# EAGLE design MRA11 (EAGLE 5.11)
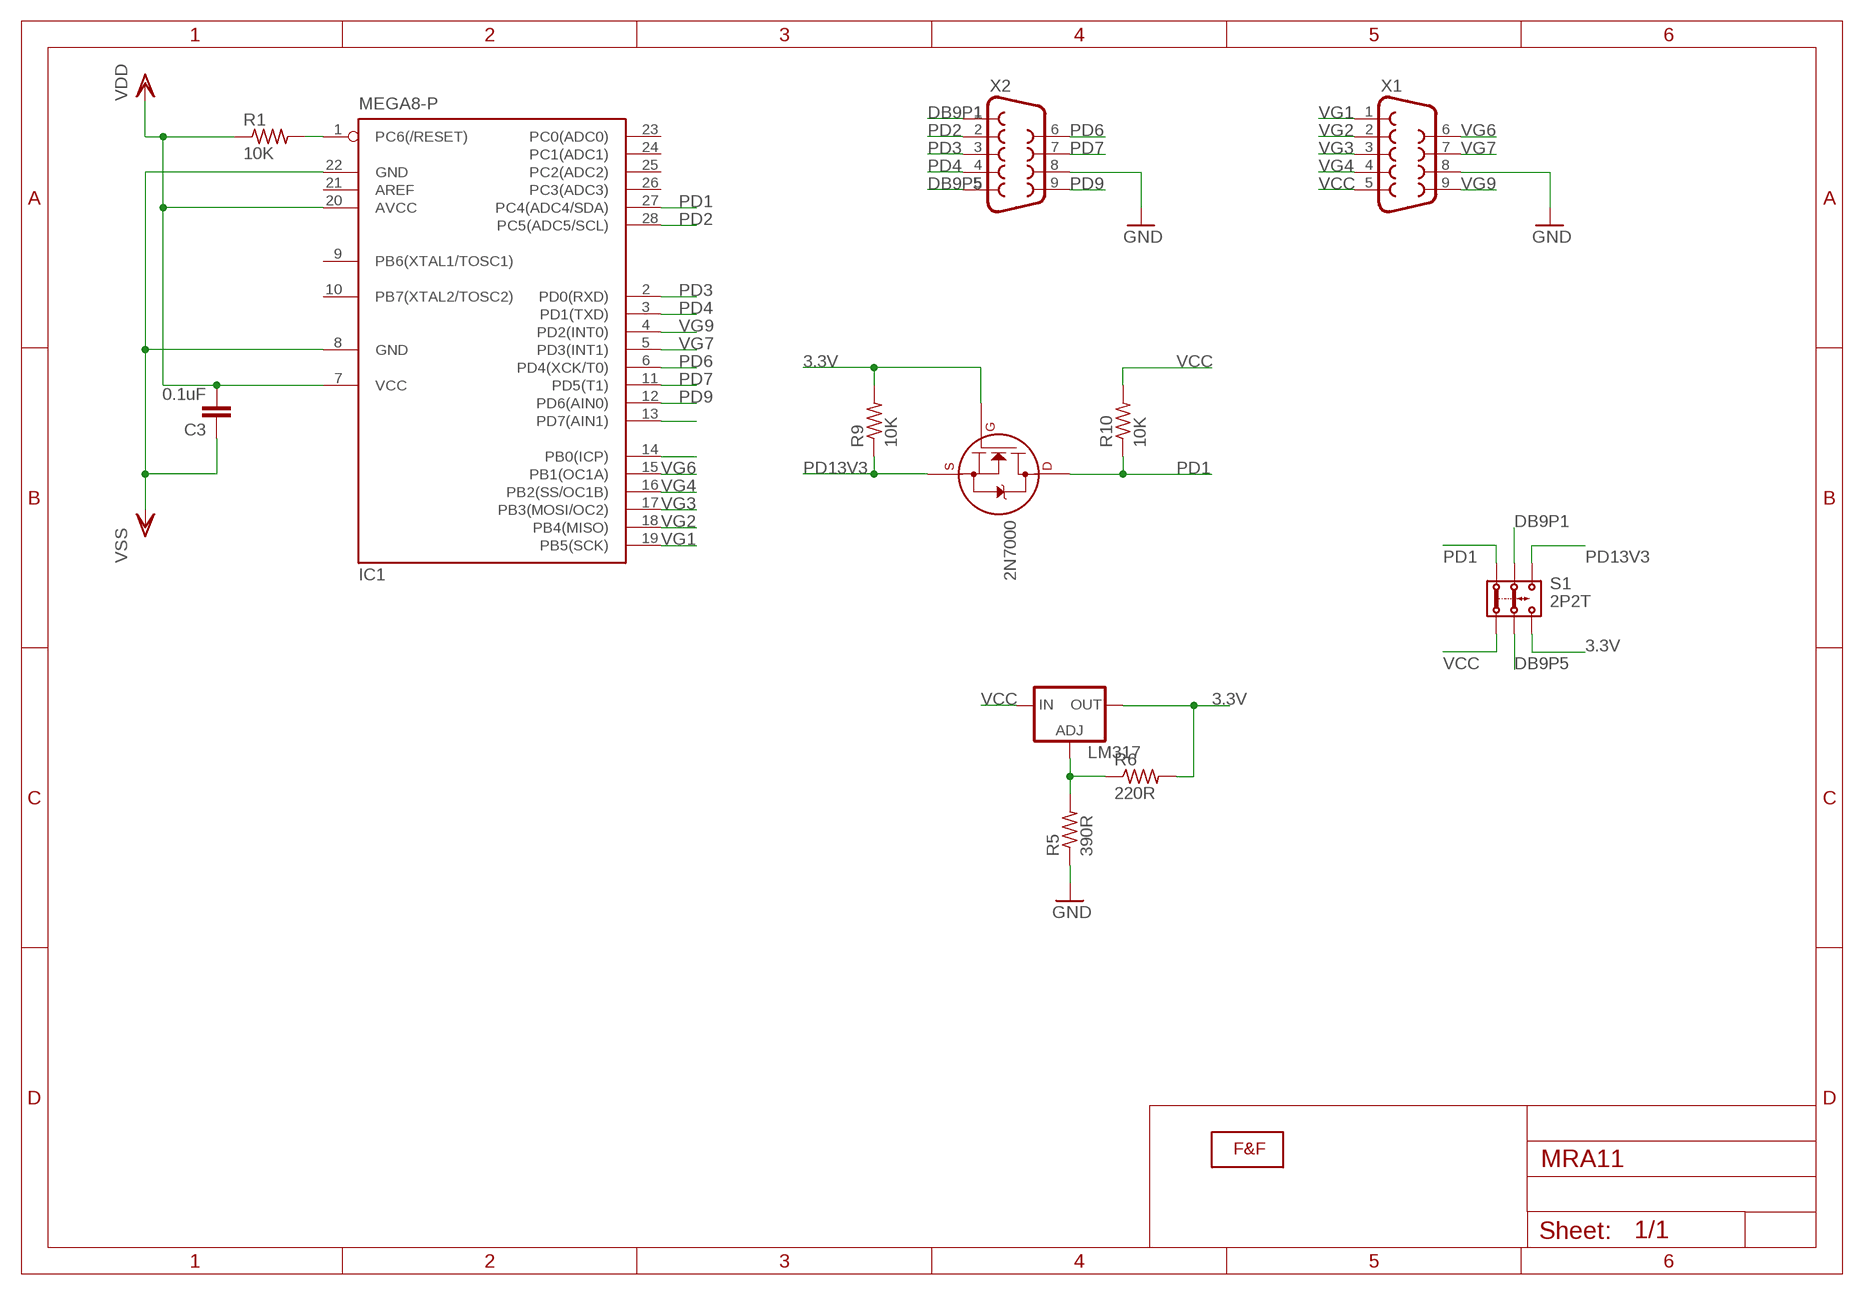
[diagram p0: schematic, sheet 1]

## Parts
2N7000  2N7000_TO92  [TO-92]
C3  0.1uF  C-EU050-024X044  [C050-024X044]
IC1  MEGA8-P  [DIL28-3]
LM317  LM317TS  [317TS]
R1  10K  R-US_0207/10  [0207/10]
R5  390R  R-US_0207/10  [0207/10]
R6  220R  R-US_0207/10  [0207/10]
R9  10K  R-US_0207/10  [0207/10]
R10  10K  R-US_0207/10  [0207/10]
S1  2P2T  [2P2T]
U$1  LOGOLOGO_WITHOUT_SMOKE_SMALL  [LOGO2_SMALL]
X1  DB9MALE  [DB9_MALE]
X2  DB9MALE  [DB9_MALE]

## Nets
3.3V: 2N7000.2(G) LM317.2(OUT) R6.2 R9.2 S1.3.2
DB9P1: S1.2.1 X2.1
DB9P5: S1.2.2 X2.5
GND: C3.1 IC1.8(GND) IC1.22(GND) R5.1 X1.8 X2.8 ; supply symbol labelled VSS
N$1: IC1.1(PC6(/RESET)) R1.2
N$2: IC1.13(PD7(AIN1))
N$4: IC1.14(PB0(ICP))
N$5: LM317.1(ADJ) R5.2 R6.1
PD1: 2N7000.3(D) IC1.27(PC4(ADC4/SDA)) R10.1 S1.1.1
PD2: IC1.28(PC5(ADC5/SCL)) X2.2
PD3: IC1.2(PD0(RXD)) X2.3
PD4: IC1.3(PD1(TXD)) X2.4
PD6: IC1.6(PD4(XCK/T0)) X2.6
PD7: IC1.11(PD5(T1)) X2.7
PD9: IC1.12(PD6(AIN0)) X2.9
PD13V3: 2N7000.1(S) R9.1 S1.3.1
VCC: C3.2 IC1.7(VCC) IC1.20(AVCC) LM317.3(IN) R1.1 R10.2 S1.1.2 X1.5 ; supply symbol labelled VDD
VG1: IC1.19(PB5(SCK)) X1.1
VG2: IC1.18(PB4(MISO)) X1.2
VG3: IC1.17(PB3(MOSI/OC2)) X1.3
VG4: IC1.16(PB2(SS/OC1B)) X1.4
VG6: IC1.15(PB1(OC1A)) X1.6
VG7: IC1.5(PD3(INT1)) X1.7
VG9: IC1.4(PD2(INT0)) X1.9
Unconnected: IC1.9(PB6(XTAL1/TOSC1)) IC1.10(PB7(XTAL2/TOSC2)) IC1.21(AREF) IC1.23(PC0(ADC0)) IC1.24(PC1(ADC1)) IC1.25(PC2(ADC2)) IC1.26(PC3(ADC3))

## Library data of the parts
2N7000 = transistors:2N700*: 2N7000, 2N7002, NDS7002A N-channel enhancement mode MOSFET
C3 = rcl:C-EU: CAPACITOR, European symbol
IC1 = atmel:MEGA8-P: MICROCONTROLLER 8 Kbytes FLASH, 1 kbytes SRAM, 512 bytes EEPROM, USART, 4-channel 10 bit ADC, 2-channel 8 bit ADC Pin compatible with Atmega48, ATMega88, ATMega168 Source: avr.lbr; OC_FARNELL: unknown; OC_NEWARK: unknown
LM317 = v-reg:LM317TS: VOLTAGE REGULATOR
R1 R5 R6 R9 R10 = adafruit:R-US_: RESISTOR, American symbol
S1 = Itead_BP_110825:2P2T: BAS011
U$1 = F&F:LOGO: Faísca e Fumaça Logo faiscaefumaca.com.br
X1 X2 = SparkFun:DB9: DB9 Connector Standard DB9 (D-Sub 9) serial connector. Can be used for CAN bus as well as RS485 and RS232. Footprint production proven. Spark Fun Electronics SKU : PRT-00429

## Board
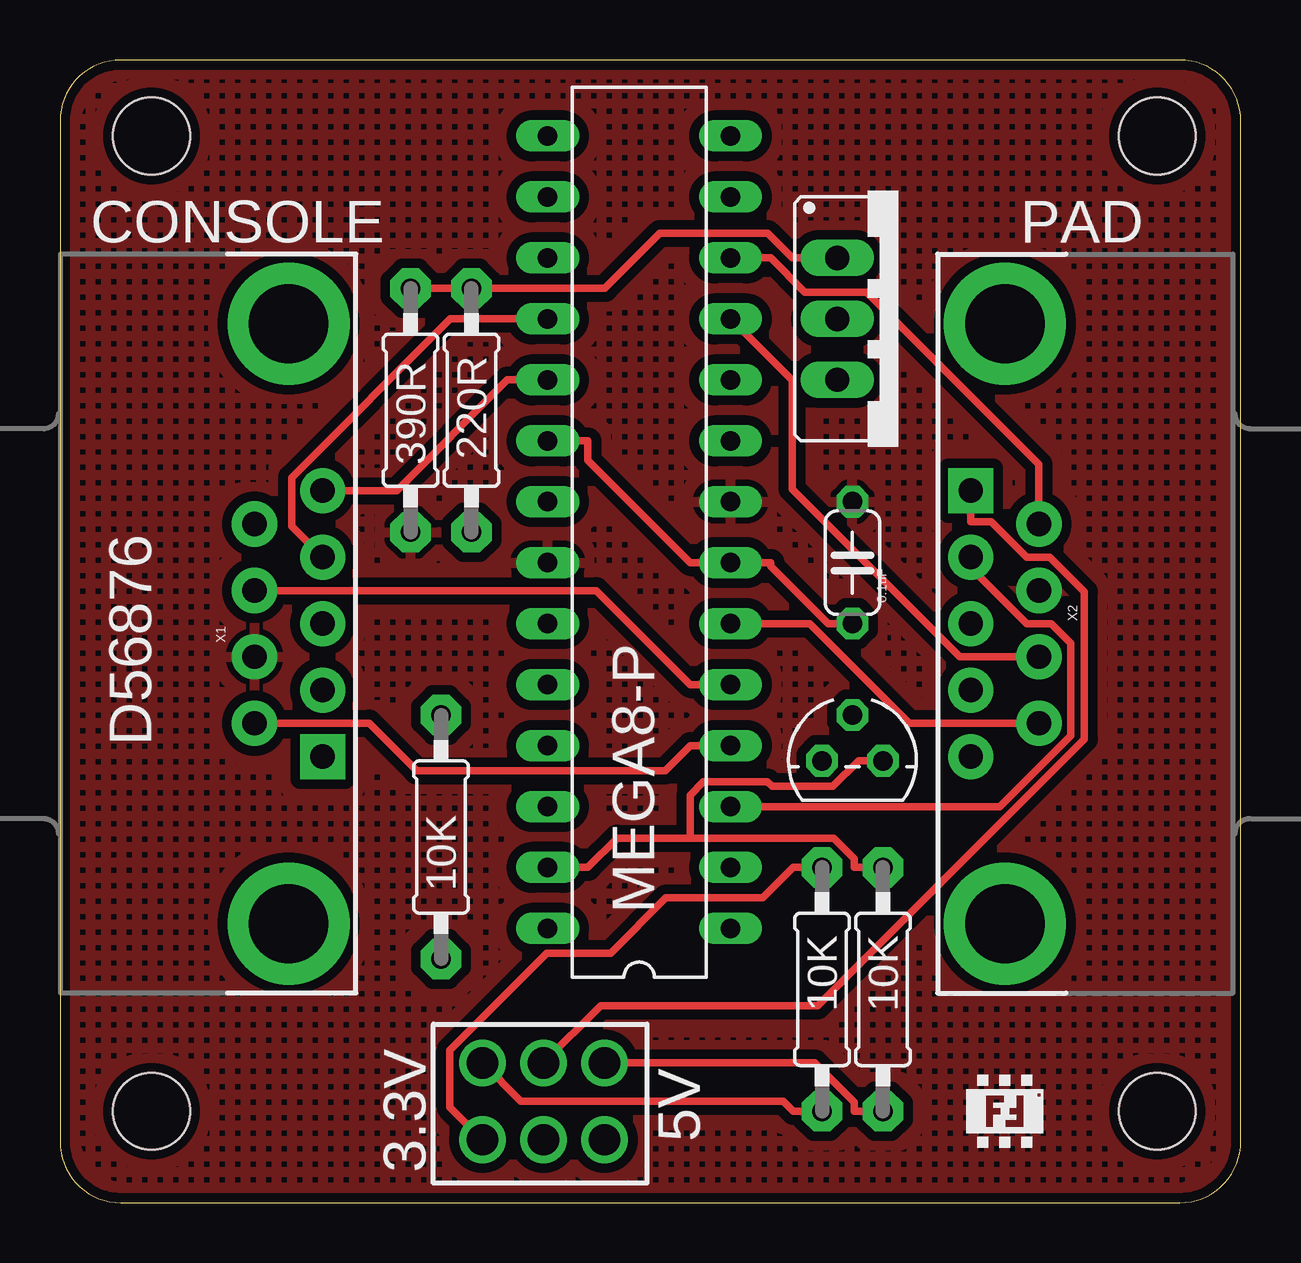
[diagram p1: board, top side]
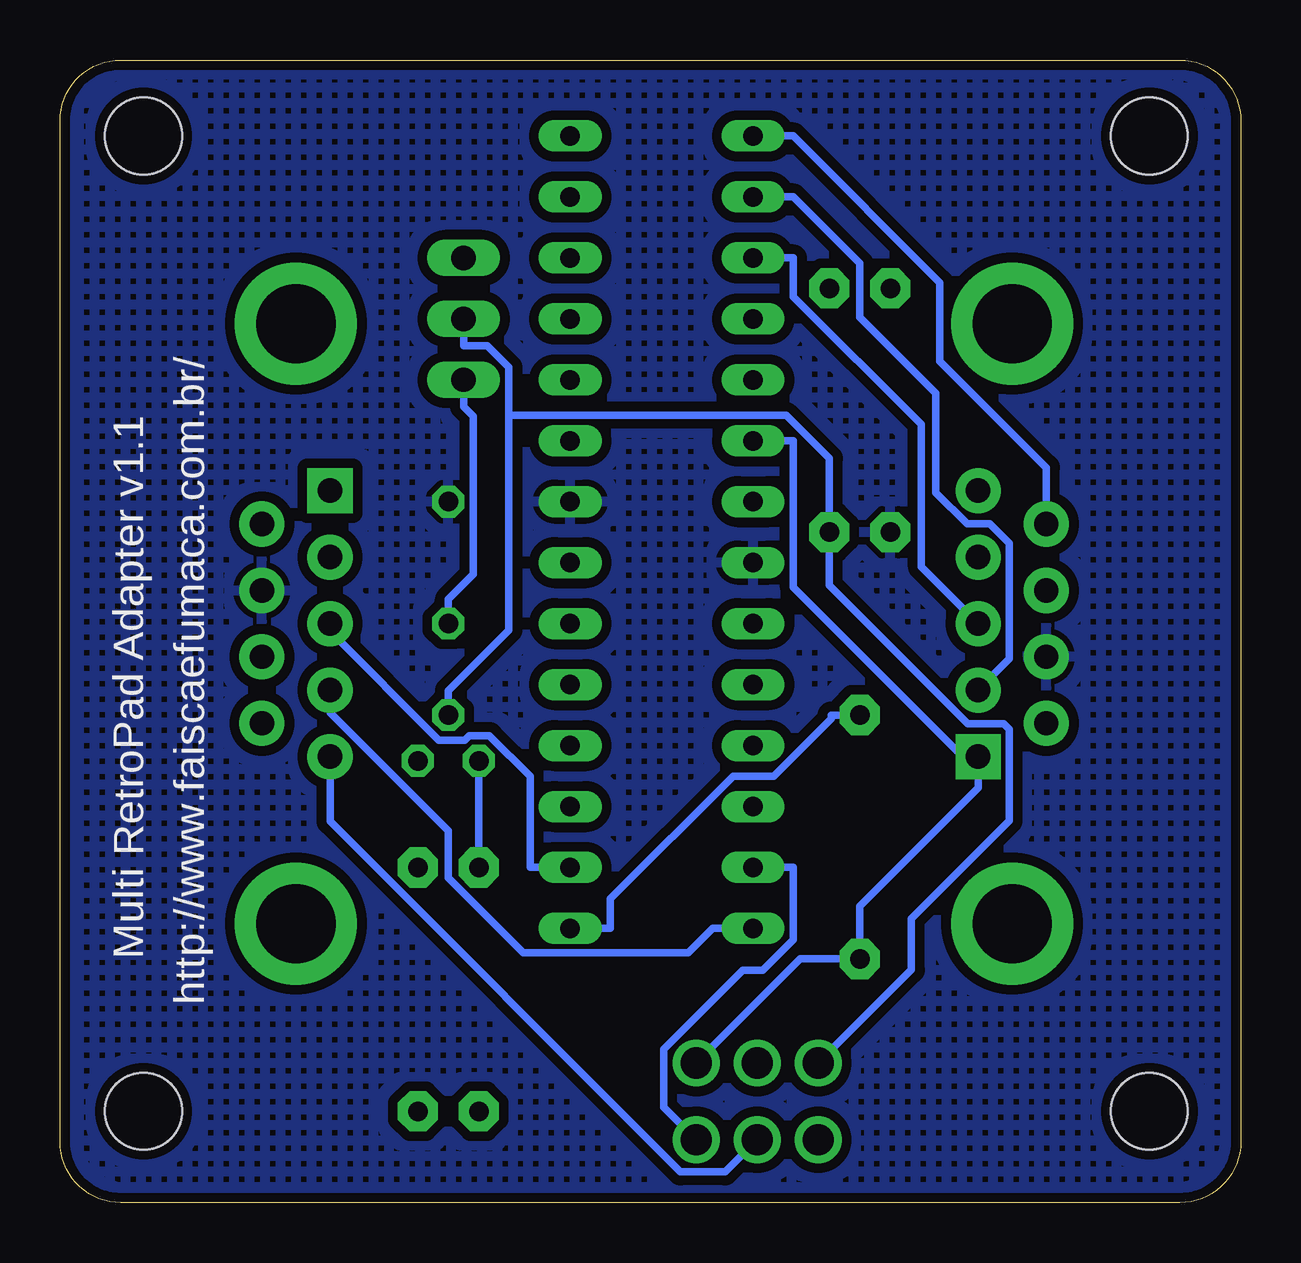
[diagram p2: board, bottom side, seen from below]

Size 49.2 x 47.62 mm. Coordinates in mm from the lower left corner, seen from the top.
Outline: 49.2,45.08 arc90 46.66,47.62 2.54,47.62 arc90 0,45.08 0,2.54 arc90 2.54,0 46.66,0 arc90 49.2,2.54 49.2,45.08
Copper layers (1*16): Top 0.035mm / dielectric 1.5mm / Bottom 0.035mm
Design rules "Fusion_eagle_rule_v1.1": minimum track width 6mil, minimum drill 12mil, track to track 6mil, track to pad 6mil, pad to pad 6mil, via to via 6mil, smd to smd 0mil, copper to edge 10mil, drill to drill 10mil, minimum pad ring 10mil, minimum via ring 6mil, stop-mask expansion 2mil, vias tented up to drill 100mil, thermal gap 10mil
Holes 3.2 mm at 3.81,44.45 3.81,3.81 45.72,44.45 45.72,3.81

### Footprints (pad centres in the part's own frame; a part is rotated, then mirrored left to right if it is on the bottom)
TO-92 = drill 0.813 octagon: 1 -1.27,0; 2 0,1.905; 3 1.27,0
C050-024X044 = drill 0.813 octagon: 1 -2.54,0; 2 2.54,0
DIL28-3 = drill 0.813 long: 1 -16.51,-3.81; 2 -13.97,-3.81; 3 -11.43,-3.81; 4 -8.89,-3.81; 5 -6.35,-3.81; 6 -3.81,-3.81; 7 -1.27,-3.81; 8 1.27,-3.81; 9 3.81,-3.81; 10 6.35,-3.81; 11 8.89,-3.81; 12 11.43,-3.81; 13 13.97,-3.81; 14 16.51,-3.81; 15 16.51,3.81; 16 13.97,3.81; 17 11.43,3.81; 18 8.89,3.81; 19 6.35,3.81; 20 3.81,3.81; 21 1.27,3.81; 22 -1.27,3.81; 23 -3.81,3.81; 24 -6.35,3.81; 25 -8.89,3.81; 26 -11.43,3.81; 27 -13.97,3.81; 28 -16.51,3.81
317TS = drill 1.016 long: 1 -2.54,-2.54; 2 0,-2.54; 3 2.54,-2.54
0207/10 = drill 0.813 pad 1.676 octagon: 1 -5.08,0; 2 5.08,0
2P2T = drill 1.3 pad 1.93 round: 1.1 -3.635,-0.085; 1.2 -3.635,-3.285; 2.1 -1.095,-0.085; 2.2 -1.095,-3.285; 3.1 1.445,-0.085; 3.2 1.445,-3.285
DB9_MALE = drill 1.016 pad 1.88 round: 1 5.54,-1.42; 2 2.77,-1.42; 3 0,-1.42; 4 -2.77,-1.42; 6 4.15,1.42; 7 1.38,1.42; 8 -1.38,1.42; 9 -4.15,1.42 | drill 1.016 pad 1.88 square: 5 -5.54,-1.42 | drill 3.302 pad 5.08 round: G1 -12.5,0; G2 12.5,0

### Placement (x,y rotation side)
2N7000  33.02,18.41 0 top
C3  33.02,26.67 270 top
IC1  24.13,27.94 90 top
LM317  34.92,36.83 270 top
R1  15.88,15.24 90 top
R5  14.61,33.02 90 top
R6  17.14,33.02 270 top
R9  31.75,8.89 270 top
R10  34.29,8.89 270 top
S1  19.05,2.54 180 top
U$1  39.37,3.81 0 top
X1  9.53,24.13 90 top
X2  39.37,24.13 270 top

### Tracks (layer width: path | path; a pad name or v marks a point on that pad's centre or on a via)
3.3V
  Top 0.305: R9.2 30.56,3.81 30.14,4.22 19.2,4.22 S1.3.2
  Bottom 0.305: 30.5,32.81 30.5,34.81 31.41,35.71 32.38,35.71 LM317.2 | 30.5,32.81 30.5,23.86 33.02,21.34 2N7000.2 | 30.5,32.81 18.94,32.81 17.14,31.01 R6.2 17.14,25.72 11.38,19.96 9.88,19.96 9.65,19.72 9.65,15.91 13.73,11.83 13.73,9.7 S1.3.2
DB9P1
  Bottom 0.305: X2.1 37.95,15.89 23.35,1.29 21.48,1.29 S1.2.1
DB9P5
  Top 0.305: X2.5 37.95,28.38 38.81,28.38 40.29,26.89 41.24,26.89 42.68,25.45 42.68,19.32 31.57,8.21 22.53,8.21 S1.2.2
GND
  pour Bottom (isolate 0.406, hatched): 0,48.26 49.53,48.26 49.53,0 0,0
  pour Top (isolate 0.406, hatched): 0,48.26 49.53,48.26 49.53,0 0,0
N$1
  Bottom 0.305: IC1.1 26.26,11.43 26.26,12.67 21.15,17.78 19.46,17.78 17.07,20.17 17.07,20.32 R1.2
N$5
  Top 0.305: R5.2 R6.1 22.7,38.1 24.99,40.39 29.49,40.39 30.5,39.37 LM317.1
PD1
  Top 0.305: 26.25,15.19 32.25,15.19 33.1,14.34 33.1,13.97 R10.1 | 26.25,15.19 23.21,15.19 22,13.97 IC1.27 | 26.25,15.19 26.25,16.98 26.81,17.54 29.48,17.54 29.67,17.35 32.21,17.35 33.27,18.41 2N7000.3
  Bottom 0.305: IC1.27 18.64,13.97 18.64,10.96 19.91,9.69 20.74,9.69 24.03,6.4 24.03,3.97 S1.1.1
PD2
  Bottom 0.305: IC1.28 22,11.43 23.01,10.41 29.9,10.41 33.02,13.54 33.02,15.49 37.95,20.42 X2.2
PD3
  Bottom 0.305: IC1.2 29.62,13.97 29.62,17.77 31.31,19.46 32.14,19.46 32.33,19.27 33.41,19.27 37.95,23.81 X2.3
PD4
  Top 0.305: X2.4 37.95,26.46 40.28,24.13 41.3,24.13 42.11,23.32 42.11,19.46 39.16,16.51 IC1.3
PD6
  Top 0.305: X2.6 35.39,19.98 31.24,24.13 IC1.6
PD7
  Top 0.305: X2.7 37.48,22.75 30.5,29.73 30.5,34.27 IC1.11
PD9
  Top 0.305: IC1.12 29.62,39.37 31.04,37.95 33.61,37.95 40.79,30.77 X2.9
PD13V3
  Top 0.305: R9.1 30.56,13.97 29.29,12.7 25.24,12.7 22.94,10.39 20.28,10.39 16.25,6.36 16.25,3.98 S1.3.1
  Bottom 0.305: R9.1 2N7000.1
VCC
  Top 0.305: C3.2 32,24.13 29.62,26.52 29.62,26.67 IC1.7 26.26,26.67 22,30.94 22,31.75 IC1.20 | R10.2 33.1,3.81 33.1,4.18 31.45,5.83 S1.1.2
  Bottom 0.305: LM317.3 32.38,33.17 31.99,32.78 31.99,26.18 33.02,25.15 C3.2 | S1.1.2 18.35,10.16 R1.1 15.88,12.36 10.95,17.29 10.95,17.94 | IC1.20 18.64,31.75 18.64,25.64 10.95,17.94 | 10.95,17.94 X1.5
VG1
  Top 0.305: IC1.19 18.64,34.29 14.02,29.67 X1.1
VG2
  Top 0.305: IC1.18 16.27,36.83 9.65,30.21 9.65,28.2 X1.2
VG3
  Bottom 0.305: IC1.17 18.64,39.37 18.64,37.76 13.31,32.43 13.31,26.5 X1.3
VG4
  Bottom 0.305: IC1.16 18.64,41.91 15.88,39.14 15.88,36.91 12.7,33.73 12.7,29.59 11.4,28.29 10.46,28.29 9.65,27.48 9.65,22.66 X1.4
VG6
  Bottom 0.305: IC1.15 18.64,44.45 12.53,38.34 12.53,35.06 8.11,30.63 X1.6
VG7
  Top 0.305: IC1.5 26.26,21.59 22.34,25.51 X1.7
VG9
  Top 0.305: IC1.4 26.26,19.05 25.21,18 14.86,18 12.88,19.98 X1.9

### Text on the board
tPlace: CONSOLE | PAD | D56876 | 5V | 3.3V
bPlace: Multi RetroPad Adapter v1.1 | http://www.faiscaefumaca.com.br/